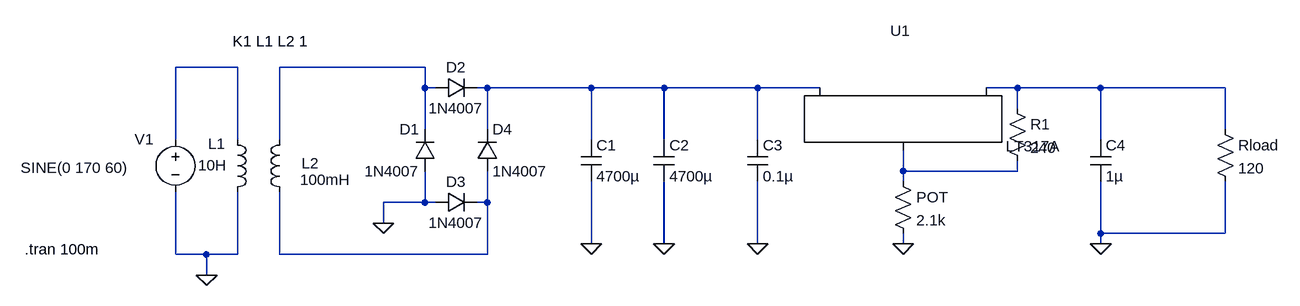
[diagram p0: schematic Linear_voltage_source.asc]
Linear_voltage_source.asc, the LTspice schematic file:
Version 4.1
SHEET 1 1432 680
WIRE -176 16 -272 16
WIRE 112 16 -112 16
WIRE 112 48 112 16
WIRE 128 48 112 48
WIRE 208 48 192 48
WIRE 368 48 208 48
WIRE 480 48 368 48
WIRE 624 48 480 48
WIRE 720 48 624 48
WIRE 1024 48 976 48
WIRE 1152 48 1024 48
WIRE 1344 48 1152 48
WIRE 1024 80 1024 48
WIRE 112 112 112 48
WIRE 208 112 208 48
WIRE 1344 112 1344 48
WIRE -272 128 -272 16
WIRE -176 128 -176 16
WIRE -112 128 -112 16
WIRE 368 128 368 48
WIRE 480 128 480 48
WIRE 624 128 624 48
WIRE 1152 128 1152 48
WIRE 848 176 848 144
WIRE 1024 176 1024 160
WIRE 1024 176 848 176
WIRE 848 192 848 176
WIRE 112 224 112 176
WIRE 112 224 48 224
WIRE 128 224 112 224
WIRE 208 224 208 176
WIRE 208 224 192 224
WIRE 48 256 48 224
WIRE 1152 272 1152 192
WIRE 1344 272 1344 192
WIRE 1344 272 1152 272
WIRE 368 288 368 192
WIRE 480 288 480 192
WIRE 624 288 624 192
WIRE 848 288 848 272
WIRE 1152 288 1152 272
WIRE -272 304 -272 208
WIRE -224 304 -272 304
WIRE -176 304 -176 208
WIRE -176 304 -224 304
WIRE -112 304 -112 208
WIRE 208 304 208 224
WIRE 208 304 -112 304
WIRE -224 336 -224 304
FLAG -224 336 0
FLAG 48 256 0
FLAG 368 288 0
FLAG 480 288 0
FLAG 624 288 0
FLAG 1152 288 0
FLAG 848 288 0
SYMBOL ind -192 112 R0
WINDOW 0 -30 22 Left 2
WINDOW 3 -45 55 Left 2
SYMATTR InstName L1
SYMATTR Value 10H
SYMATTR Type ind
SYMATTR SpiceLine Rser=1m
SYMBOL ind -96 224 R180
WINDOW 0 -45 60 Left 2
WINDOW 3 -94 35 Left 2
SYMATTR InstName L2
SYMATTR Value 100mH
SYMATTR Type ind
SYMATTR SpiceLine Rser=1m
SYMBOL voltage -272 112 R0
WINDOW 0 -63 15 Left 2
WINDOW 3 -238 59 Left 2
WINDOW 123 0 0 Left 0
WINDOW 39 0 0 Left 0
SYMATTR InstName V1
SYMATTR Value SINE(0 170 60)
SYMBOL diode 128 176 R180
WINDOW 0 24 64 Left 2
WINDOW 3 24 0 Left 2
SYMATTR InstName D1
SYMATTR Value 1N4007
SYMBOL diode 128 64 R270
WINDOW 0 32 32 VTop 2
WINDOW 3 0 32 VBottom 2
SYMATTR InstName D2
SYMATTR Value 1N4007
SYMBOL diode 128 240 R270
WINDOW 0 32 32 VTop 2
WINDOW 3 0 32 VBottom 2
SYMATTR InstName D3
SYMATTR Value 1N4007
SYMBOL diode 192 176 M180
WINDOW 0 24 64 Left 2
WINDOW 3 24 0 Left 2
SYMATTR InstName D4
SYMATTR Value 1N4007
SYMBOL cap 352 128 R0
SYMATTR InstName C1
SYMATTR Value 4700µ
SYMBOL cap 464 128 R0
SYMATTR InstName C2
SYMATTR Value 4700µ
SYMBOL PowerProducts\\LT317A 848 48 R0
WINDOW 0 -4 -72 Bottom 2
SYMATTR InstName U1
SYMBOL cap 608 128 R0
SYMATTR InstName C3
SYMATTR Value 0.1µ
SYMBOL cap 1136 128 R0
SYMATTR InstName C4
SYMATTR Value 1µ
SYMBOL res 1008 64 R0
SYMATTR InstName R1
SYMATTR Value 240
SYMBOL res 832 176 R0
SYMATTR InstName POT
SYMATTR Value 2.1k
SYMBOL res 1328 96 R0
SYMATTR InstName Rload
SYMATTR Value 120
TEXT -504 296 Left 2 !.tran 100m
TEXT -184 -24 Left 2 !K1 L1 L2 1

The netlist it stands for:
* Linear_voltage_source.asc
L1 N001 0 10H Rser=1m
L2 N006 N002 100mH Rser=1m
V1 N001 0 SINE(0 170 60)
D1 0 N002 1N4007
D2 N002 N003 1N4007
D3 0 N006 1N4007
D4 N006 N003 1N4007
C1 N003 0 4700µ
C2 N003 0 4700µ
X§U1 N005 N004 N003 LT317A
C3 N003 0 0.1µ
C4 N004 0 1µ
R1 N004 N005 240
R§POT N005 0 2.1k
Rload N004 0 120
.model D D
.lib standard.dio
.tran 100m
K1 L1 L2 1
.lib LTC.lib
.backanno
.end